# EAGLE design Group 5 (EAGLE 7.1.0)
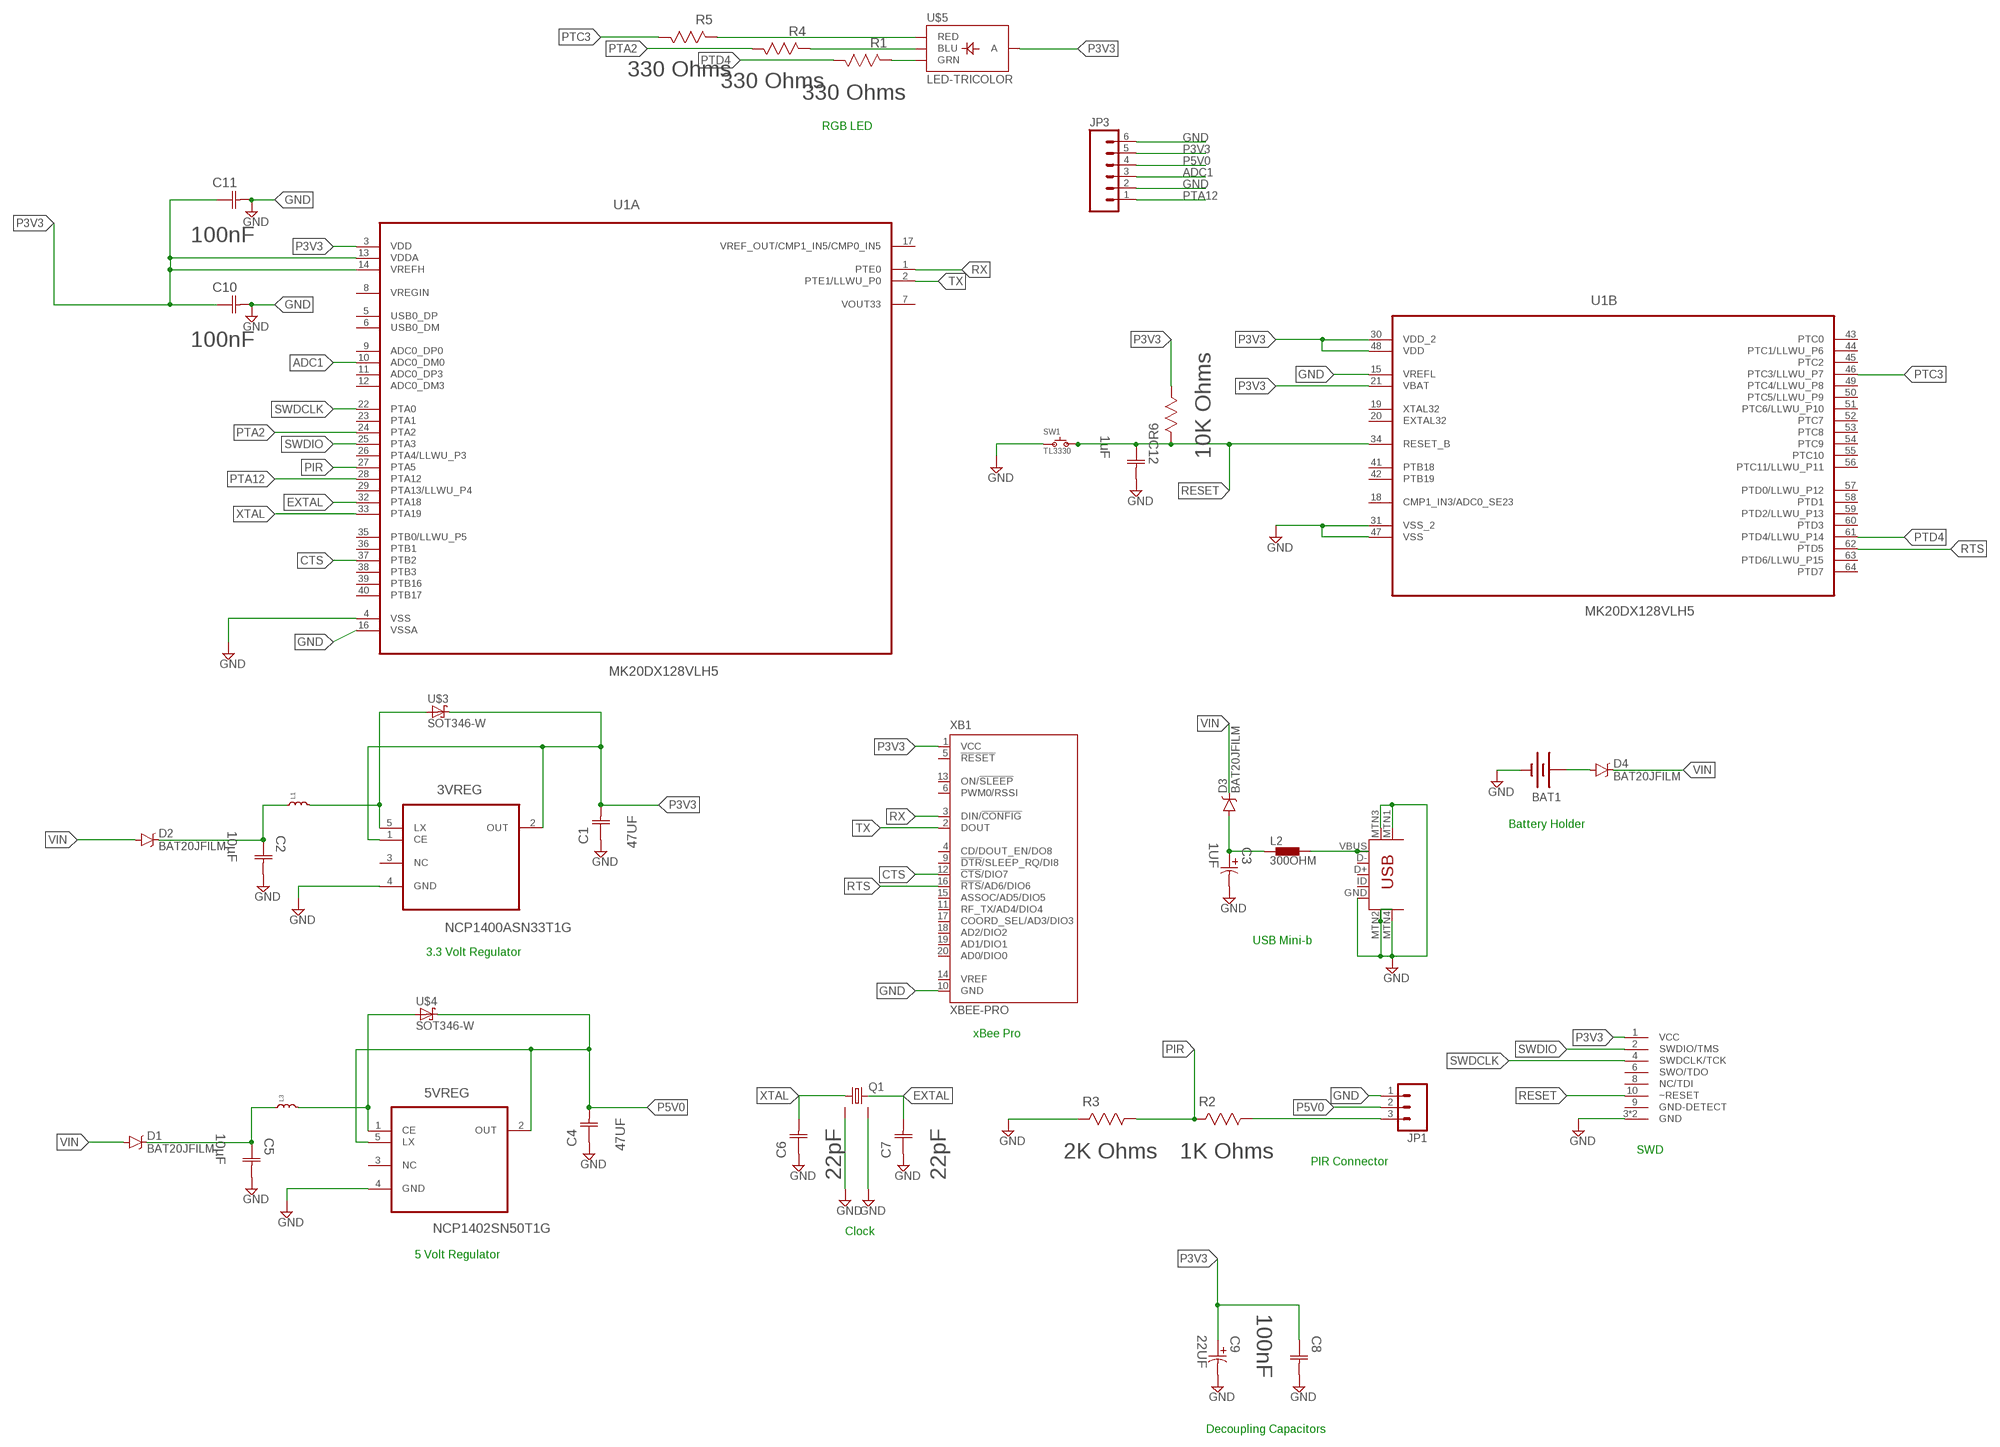
[diagram p0: schematic, sheet 1]

## Parts
3VREG  NCP1400ASN33T1G  [SOT95P275X110-5N]
5VREG  NCP1402SN50T1G  [SOT95P275X110-5N]
BAT1  BATTERY20PTH  [BATTCOM_20MM_PTH]
C1  47UF  TPSC476M010R0350  [CAPCP6032X280N]
C2  10µF  TAJC106M020R  [CAPCP6032X280N]
C3  1UF  EEE-1HA010SR-CASE-B  [CAPAE430X610N]
C4  47UF  TPSC476M010R0350  [CAPCP6032X280N]
C5  10µF  TAJC106M020R  [CAPCP6032X280N]
C6  22pF  C0603C220J5GACTU  [CAPC1608X85N]
C7  22pF  C0603C220J5GACTU  [CAPC1608X85N]
C8  100nF  CC0805KRX7R9BB104  [CAPC2013X95N]
C9  22UF  EEE-FT1V220AR-CASE-B  [CAPAE430X610N]
C10  100nF  CC0805KRX7R9BB104  [CAPC2013X95N]
C11  100nF  CC0805KRX7R9BB104  [CAPC2013X95N]
C12  1uF  0603YC105KAT2A  [CAPC1608X94N]
D1  BAT20JFILM  [SOD-323]
D2  BAT20JFILM  [SOD-323]
D3  BAT20JFILM  [SOD-323]
D4  BAT20JFILM  [SOD-323]
JP1  M03PTH  [1X03]
JP3  M06LONGPADS  [1X06_LONGPADS]
L1  INDUCTOR-SDR0403  [SDR0403]
L2  300OHM  BLM15HB121SN1  [0402]
L3  INDUCTOR-SDR0403  [SDR0403]
Q1  CRYSTALCTS406  [CTS406]
R1  330 Ohms  MC0.1W08051%330R  [RESC2013X65N]
R2  1K Ohms  MC0.125W12061%1K  [RESC3216X71N]
R3  2K Ohms  MC0.125W12061%2K  [RESC3216X71N]
R4  330 Ohms  MC0.1W08051%330R  [RESC2013X65N]
R5  330 Ohms  MC0.1W08051%330R  [RESC2013X65N]
R6  10K Ohms  MC0.063W06035%10K  [RESC1608X60N]
SW1  TL3330  [TL3330]
U1  MK20DX128VLH5  [QFP50P1200X1200X160-64N]
U$1  2X5_0.05"_CORTEX_DEBUGTH_NOKEY_UNSHROUDED  [2X5_0.05"_TH_NS]
U$2  USB-MINIB-5PIN  [USB-MINIB]
U$3  SOT346-W  [SOT346-W]
U$4  SOT346-W  [SOT346-W]
U$5  LED-TRICOLOR  [LED-TRICOLOR-SMD]
XB1  XBEE-PRO  [XBEE-PRO]

## Nets
ADC1: JP3.3 U1.10(A:ADC0_DM0)
CTS: U1.37(A:PTB2) XB1.12(!CTS!/DIO7)
EXTAL: C7.2(C2) Q1.3 U1.32(A:PTA18)
GND: 3VREG.4(GND) 5VREG.4(GND) BAT1.2(-) C1.1(C1) C2.2(C2) C3.2 C4.1(C1) C5.2(C2) C6.1(C1) C7.1(C1) C8.2(C2) C9.2 C10.2(C2) C11.2(C2) C12.2(C2) JP1.1 JP3.2 JP3.6 Q1.2(GND1) Q1.4(GND2) R3.2(R2) SW1.1 U1.4(A:VSS) U1.15(B:VREFL) U1.16(A:VSSA) U1.31(B:VSS_2) U1.47(B:VSS) U$1.3(GND) U$1.5(GND) U$2.GND U$2.MTN1(MTN2) U$2.MTN2(MTN3) U$2.MTN3(MTN1) U$2.MTN4 XB1.10(GND)
N$1: 3VREG.5(LX) L1.2 U$3.1(A)
N$2: L2.2 U$2.VBUS
N$3: 5VREG.1(CE) L3.2 U$4.1(A)
N$5: JP1.3 R2.1(R1)
N$6: R1.2(R2) U$5.G(GRN)
N$7: R4.2(R2) U$5.B(BLU)
N$8: R5.2(R2) U$5.R(RED)
N$10: BAT1.1(+) D4.A
P3V3: 3VREG.1(CE) 3VREG.2(OUT) C1.2(C2) C8.1(C1) C9.1 C10.1(C1) C11.1(C1) JP3.5 R6.1(R1) U1.3(A:VDD) U1.13(A:VDDA) U1.14(A:VREFH) U1.21(B:VBAT) U1.30(B:VDD_2) U1.48(B:VDD) U$1.1(VCC) U$3.3(C) U$5.A XB1.1(VCC)
P5V0: 5VREG.2(OUT) 5VREG.5(LX) C4.2(C2) JP1.2 JP3.4 U$4.3(C)
PIR: R2.2(R2) R3.1(R1) U1.27(A:PTA5)
PTA2: R4.1(R1) U1.24(A:PTA2)
PTA12: JP3.1 U1.28(A:PTA12)
PTC3: R5.1(R1) U1.46(B:PTC3/LLWU_P7)
PTD4: R1.1(R1) U1.61(B:PTD4/LLWU_P14)
RE: C2.1(C1) D2.C L1.1
RE3: C5.1(C1) D1.C L3.1
RESET: C12.1(C1) R6.2(R2) SW1.2 U1.34(B:RESET_B) U$1.10(~RESET)
RTS: U1.62(B:PTD5) XB1.16(!RTS!/AD6/DIO6)
RX: U1.1(A:PTE0) XB1.3(DIN/!CONFIG)
SWDCLK: U1.22(A:PTA0) U$1.4(SWDCLK/TCK)
SWDIO: U1.25(A:PTA3) U$1.2(SWDIO/TMS)
TX: U1.2(A:PTE1/LLWU_P0) XB1.2(DOUT)
VIN: D1.A D2.A D3.C D4.C
VIN3: C3.1 D3.A L2.1
XTAL: C6.2(C2) Q1.1 U1.33(A:PTA19)
Unconnected: 3VREG.3(NC) 5VREG.3(NC) U1.5(A:USB0_DP) U1.6(A:USB0_DM) U1.7(A:VOUT33) U1.8(A:VREGIN) U1.9(A:ADC0_DP0) U1.11(A:ADC0_DP3) U1.12(A:ADC0_DM3) U1.17(A:VREF_OUT/CMP1_IN5/CMP0_IN5) U1.18(B:CMP1_IN3/ADC0_SE23) U1.19(B:XTAL32) U1.20(B:EXTAL32) U1.23(A:PTA1) U1.26(A:PTA4/LLWU_P3) U1.29(A:PTA13/LLWU_P4) U1.35(A:PTB0/LLWU_P5) U1.36(A:PTB1) U1.38(A:PTB3) U1.39(A:PTB16) U1.40(A:PTB17) U1.41(B:PTB18) U1.42(B:PTB19) U1.43(B:PTC0) U1.44(B:PTC1/LLWU_P6) U1.45(B:PTC2) U1.49(B:PTC4/LLWU_P8) U1.50(B:PTC5/LLWU_P9) U1.51(B:PTC6/LLWU_P10) U1.52(B:PTC7) U1.53(B:PTC8) U1.54(B:PTC9) U1.55(B:PTC10) U1.56(B:PTC11/LLWU_P11) U1.57(B:PTD0/LLWU_P12) U1.58(B:PTD1) U1.59(B:PTD2/LLWU_P13) U1.60(B:PTD3) U1.63(B:PTD6/LLWU_P15) U1.64(B:PTD7) U$1.6(SWO/TDO) U$1.8(NC/TDI) U$1.9(GND-DETECT) U$2.D+ U$2.D- U$2.ID XB1.4(CD/DOUT_EN/DO8) XB1.5(!RESET) XB1.6(PWM0/RSSI) XB1.9(!DTR!/SLEEP_RQ/DI8) XB1.11(RF_TX/AD4/DIO4) XB1.13(ON/!SLEEP) XB1.14(VREF) XB1.15(ASSOC/AD5/DIO5) XB1.17(COORD_SEL/AD3/DIO3) XB1.18(AD2/DIO2) XB1.19(AD1/DIO1) XB1.20(AD0/DIO0)

## Notes on the sheet
- RGB LED
- Battery Holder
- USB Mini-b
- 3.3 Volt Regulator
- xBee Pro
- SWD
- PIR Connector
- Clock
- 5 Volt Regulator
- Decoupling Capacitors

## Library data of the parts
3VREG = ON Semiconductor_By_element14_Batch_1:NCP1400ASN33T1G: Switching Regulator; MPN: NCP1400ASN33T1G; OC_FARNELL: 1652392; OC_NEWARK: 42K1839; PACKAGE: SOT-23-5; SUPPLIER: ON SEMICONDUCTOR
5VREG = ON Semiconductor_By_element14_Batch_1:NCP1402SN50T1G: 200 mA, PFM Step-Up Micropower Switching Regulator; MPN: NCP1402SN50T1G; OC_FARNELL: 1652393; OC_NEWARK: 98H0882; PACKAGE: SOT-23-5; SUPPLIER: ON SEMICONDUCTOR
BAT1 = SparkFun-Electromechanical:BATTERY: Battery Holders Various common sizes : AA, AAA, 18650 (PRT-12895), 20mm coin cell and 12mm coin cell. 20MM_4LEGS, BATT-10373
C1 C4 = AVX_By_element14_Batch_1:TPSC476M010R0350: Tantalum Capacitor , 2312; CAPACITANCETOLERANCE: ±20%; MPN: TPSC476M010R0350; OC_FARNELL: -; OC_NEWARK: 75M2932; SUPPLIER: AVX; VOLTAGERATING: 10V
C2 C5 = AVX_By_element14_Batch_1:TAJC106M020R: Tantalum Capacitor , 2312; CAPACITANCETOLERANCE: ±20%; MPN: TAJC106M020R; OC_FARNELL: -; OC_NEWARK: 75M2822; SUPPLIER: AVX; VOLTAGERATING: 20V
C3 = Panasonic-EEE0_EEE1_EEE2_EEEFC:EEE-: Aluminum Electrolytic Capacitors,Surface Mount Type; MPN: EEE-1HA010SR; OC_FARNELL: 9697063; OC_NEWARK: 96K9436; PACKAGE: CASE-B; SUPPLIER: PANASONIC; TOLERANCE: 20%; VOLTAGERATING: 50V
C6 C7 = Kemet_By_element14_Batch_1:C0603C220J5GACTU: CAPACITOR, 0603; MPN: C0603C220J5GACTU; OC_FARNELL: 1414622; OC_NEWARK: 64K2846; SUPPLIER: Kemet; TOLERANCE: ±5%; VOLTAGERATING: 50V
C8 C10 C11 = Yageo_By_element14_Batch_1:CC0805KRX7R9BB104: CAPACITOR, 0805; MPN: CC0805KRX7R9BB104; OC_FARNELL: 3019949; OC_NEWARK: 68R4910; SUPPLIER: Yageo; TOLERANCE: ±10%; VOLTAGERATING: 50V
C9 = Panasonic-EEEFT_EEEH:EEE-: Aluminum Electrolytic Capacitors,Surface Mount Type; MPN: EEE-FT1V220AR; OC_FARNELL: 1868413; OC_NEWARK: 31T8187; PACKAGE: CASE-B; SUPPLIER: PANASONIC; TOLERANCE: ±20 %; VOLTAGERATING: 35V
C12 = AVX_By_element14_Batch_1:0603YC105KAT2A: Capacitor 0603; MPN: 0603YC105KAT2A; OC_FARNELL: 1658870; OC_NEWARK: 96M1178; SUPPLIER: AVX; TOLERANCE: ±10%; VOLTAGERATING: 16V
D1-D4 = SparkFun-DiscreteSemi:BAT20JFILM: 23V, 1A Schottky diode, SOD-323 package; PROD_ID: DIO-11623
JP1 = SparkFun-Connectors:M03: Header 3 Standard 3-pin 0.1" header. Use with straight break away headers (SKU : PRT-00116), right angle break away headers (PRT-00553), swiss pins (PRT-00743), machine pins (PRT-00117), and female headers (PRT-00115). Molex polarized connector foot print use with SKU : PRT-08232 with associated crimp pins and housings.
JP3 = SparkFun-Connectors:M06: Header 6 Standard 6-pin 0.1" header. Use with straight break away headers (SKU : PRT-00116), right angle break away headers (PRT-00553), swiss pins (PRT-00743), machine pins (PRT-00117), and female headers (PRT-00115). Molex polarized connector foot print use with SKU : PRT-08094 with associated crimp pins and housings. NOTES ON THE VARIANTS LOCK and LOCK_LONGPADS... This footprint was designed to help hold the alignment of a through-hole component (i.e. 6-pin header) while soldering it into place. You may notice that each hole has been shifted either up or down by 0.005 of an inch from it's more standard position (which is a perfectly straight line). This slight alteration caused the pins (the squares in the middle) to touch the edges of the holes. Because they are alternating, it causes a "brace" to hold the component in place. 0.005 has proven to be the perfect amount of "off-center" position when using our standard breakaway headers. Although looks a little odd when you look at the bare footprint, once you have a header in there, the alteration is very hard to notice. Also,if you push a header all the way into place, it is covered up entirely on the bottom side. This idea of altering the position of holes to aid alignment will be further integrated into the Sparkfun Library for other footprints. It can help hold any component with 3 or more connection pins.
L1 L3 = bourns:INDUCTOR
L2 = inductors:BLM15H: EMIFIL (R) Chip Ferrite Bead for GHz Noise Source: http://www.murata.com/ Ferrite Bead BLM15H.pdf
Q1 = CTS406 RTC:CRYSTAL: CRYSTAL; OC_FARNELL: unknown; OC_NEWARK: unknown
R1 R4 R5 = Multicomp_By_element14_Batch_1:MC0.1W08051%330R: RESISTOR, 0805; MPN: MC0.1W08051%330R; OC_FARNELL: 9333037; OC_NEWARK: -; SUPPLIER: Multicomp; TOLERANCE: ±1%; WATTAGE: 1/10 W
R2 = Multicomp_By_element14_Batch_1:MC0.125W12061%1K: RESISTOR, 1206; MPN: MC0.125W12061%1K; OC_FARNELL: 9335757; OC_NEWARK: 39K0871; SUPPLIER: Multicomp; TOLERANCE: ±1%; WATTAGE: 1/8 W
R3 = Multicomp_By_element14_Batch_1:MC0.125W12061%2K: RESISTOR, 1206; MPN: MC0.125W12061%2K; OC_FARNELL: 9336117; OC_NEWARK: 39K0906; SUPPLIER: Multicomp; TOLERANCE: ±1%; WATTAGE: 1/8 W
R6 = Multicomp_By_element14_Batch_1:MC0.063W06035%10K: RESISTOR, 0603; MPN: MC0.063W06035%10K; OC_FARNELL: 9331700; OC_NEWARK: 39K0074; SUPPLIER: Multicomp; TOLERANCE: ±1%; WATTAGE: 1/16 W
SW1 = e-switch:TL3330
U1 = MK20DX128VLH5:MK20DX128VLH5: MCU, KINETIS, K20, CORTEX M4, LQFP-64; MPN: MK20DX128VLH5; OC_FARNELL: 2133572; OC_NEWARK: 24W6502; PACKAGE: LQFP-64; SUPPLIER: FREESCALE SEMICONDUCTOR
U$1 = con-cortex:2X5_0.05"_CORTEX_DEBUG
U$2 = SparkFun-Connectors:USB-MINIB: Mini-USB "B" connector with 5th pin broken out. Created new symbol breaking out 5th "ID" pin in mini/micro USB connector spec. See: http://en.wikipedia.org/wiki/Mini_usb#Cables. Uses same footprint as 4-pin symbol. Also added pins to connect to mounting / shield pads if required (probably not generally needed as signals aren't shielded once they leave the connector).; PROD_ID: CONN-08193
U$3 U$4 = SOT346-W:SOT346-W
U$5 = SparkFun-LED:LED-TRICOLOR: Tri-Color LED SMD Proven layout and schematic for triple color LED in SMD package - common anode. Spark Fun Electronics SKU : COM-07844
XB1 = maxstream:XBEE: XBee (TM) /XBee-PRO(TM) OEM RF Modules Source: MaxStream, Inc. xbee_productmanual.pdf; MPN: XBP24-AWI-001; OC_FARNELL: 1337916; OC_NEWARK: 42M2667

## Board
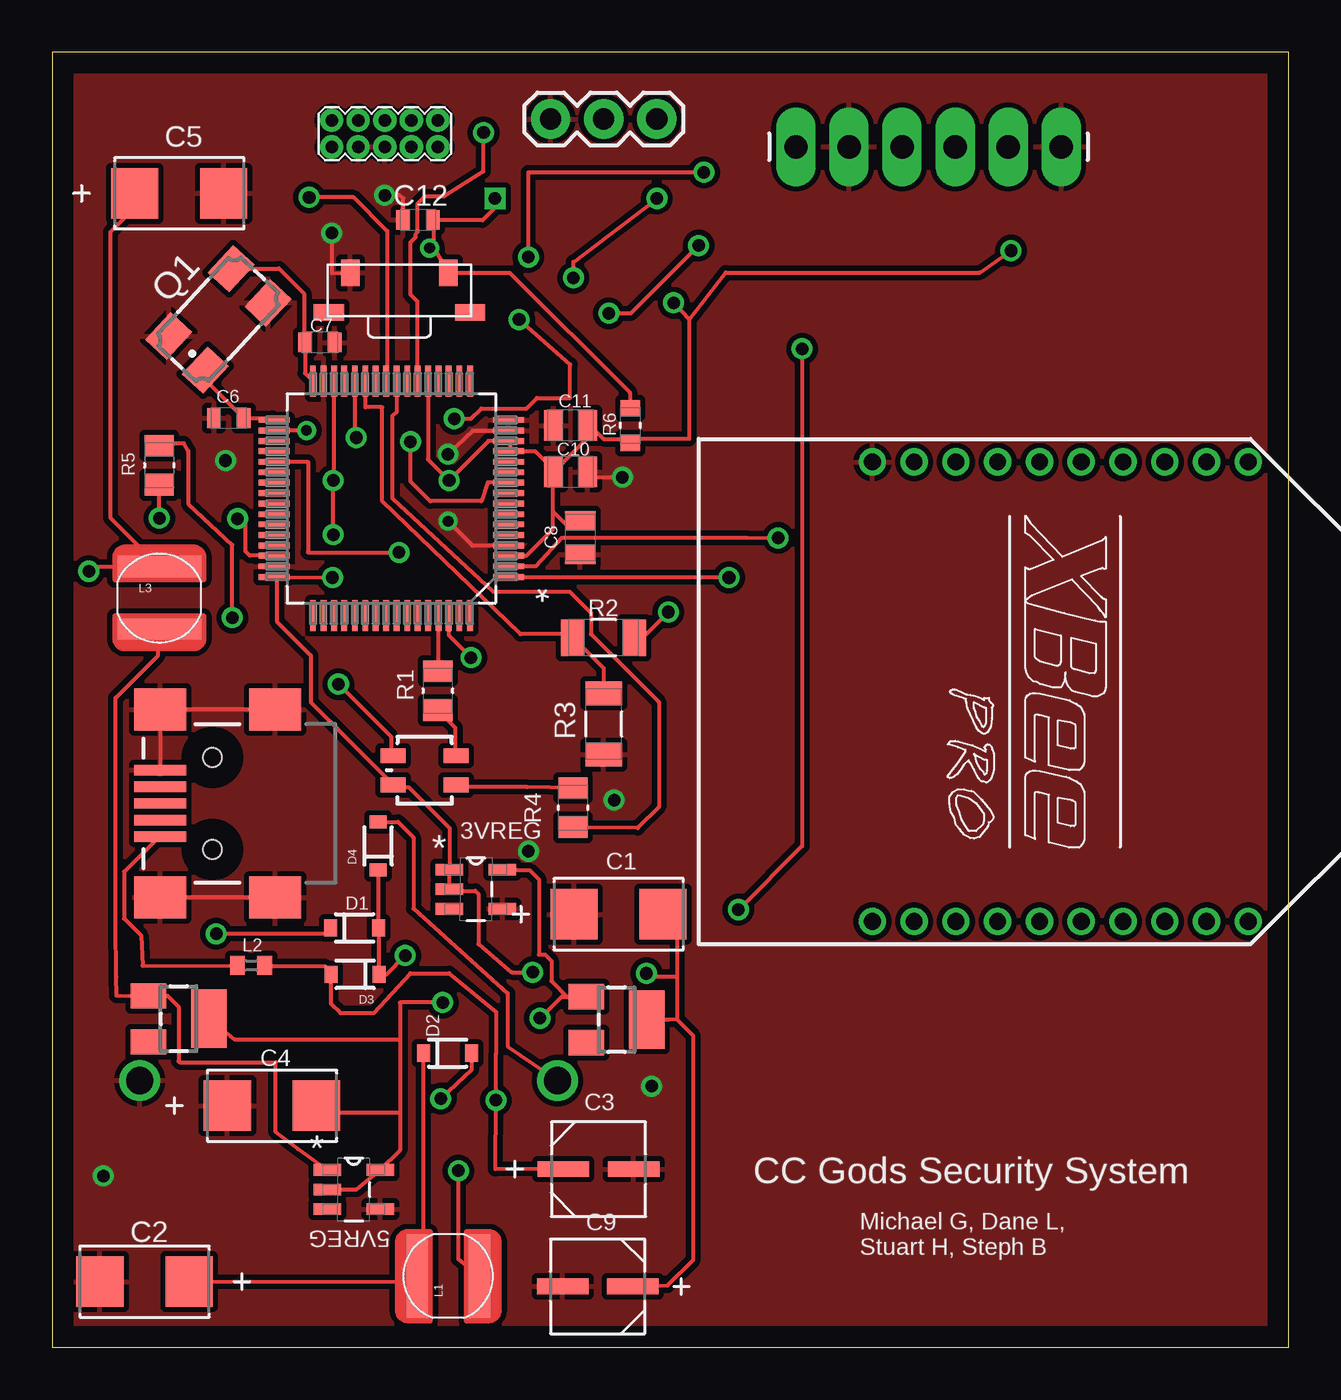
[diagram p1: board, top side]
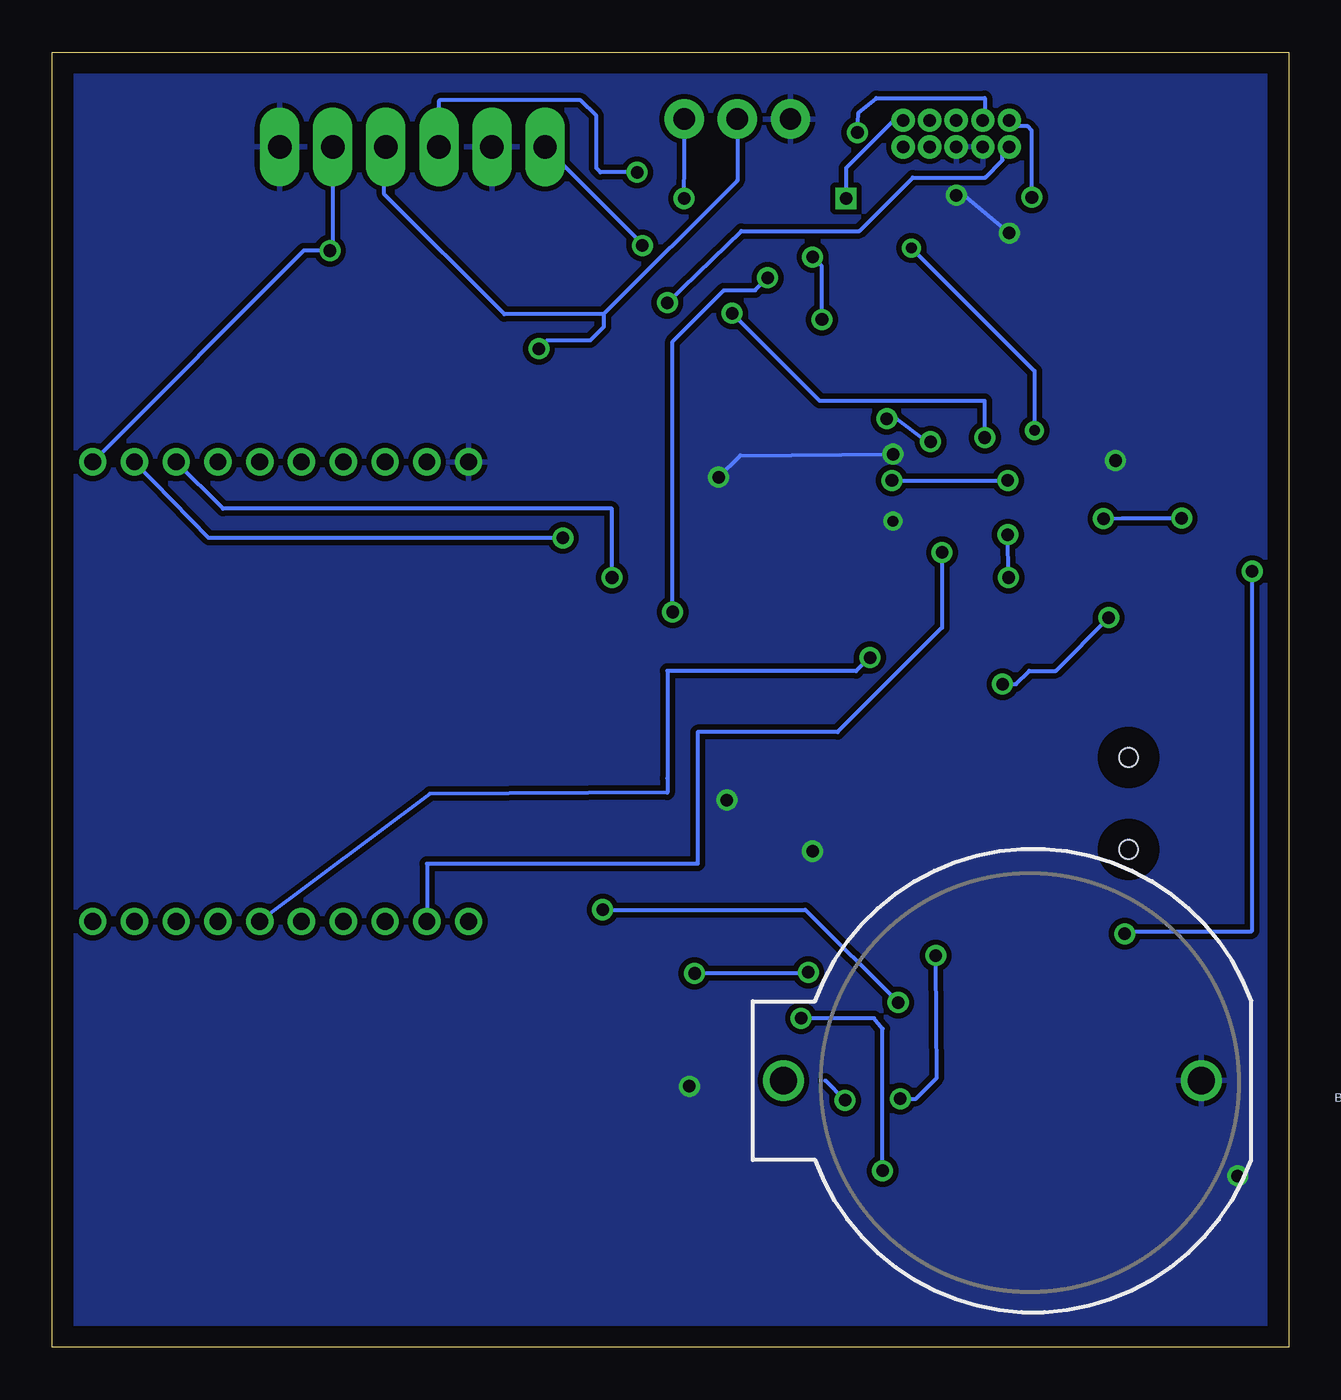
[diagram p2: board, bottom side, seen from below]

Size 59.2 x 62 mm. Coordinates in mm from the lower left corner, seen from the top.
Outline: 0,0 59.2,0 59.2,62 0,62 0,0
Copper layers (1*16): Top 0.035mm / dielectric 1.5mm / Bottom 0.035mm
Design rules "default *": minimum track width 8mil, minimum drill 20mil, track to track 8mil, track to pad 8mil, pad to pad 8mil, via to via 8mil, smd to smd 8mil, copper to edge 40mil, drill to drill 8mil, minimum pad ring 10mil, minimum via ring 8mil, stop-mask expansion 0.00203125mm, vias tented up to drill 0.5mm, thermal gap 10mil

### Footprints (pad centres in the part's own frame; a part is rotated, then mirrored left to right if it is on the bottom)
SOT95P275X110-5N = smd 1.321 x 0.559: 1 -1.27,0.94; 2 -1.27,0; 3 -1.27,-0.94; 4 1.27,-0.94; 5 1.27,0.94
BATTCOM_20MM_PTH = drill 1.3: 1 11.85,0; 2 -8.15,0
CAPCP6032X280N = smd 2.261 x 2.413: 1 -2.134,0; 2 2.134,0
CAPAE430X610N = smd 2.464 x 0.762: 1 -1.676,0; 2 1.676,0
CAPC1608X85N = smd 0.66 x 0.94: 1 -0.711,0; 2 0.711,0
CAPC2013X95N = smd 0.914 x 1.448: 1 -0.813,0; 2 0.813,0
CAPC1608X94N = smd 0.66 x 0.94: 1 -0.711,0; 2 0.711,0
SOD-323 = smd 0.63 x 0.83: A 1.15,0; C -1.15,0
1X03 = drill 1.016 pad 1.88: 1 0,0; 2 2.54,0; 3 5.08,0
1X06_LONGPADS = drill 1.118 pad 1.88 long: 1 0,0; 2 2.54,0; 3 5.08,0; 4 7.62,0; 5 10.16,0; 6 12.7,0
SDR0403 = smd 4 x 1: 1 0,1.5; 2 0,-1.5
0402 = smd 0.7 x 0.9: 1 -0.65,0; 2 0.65,0
CTS406 = smd 1.8 x 1.4: 1 -2.2,-1.2; 2 2.2,-1.2; 3 2.2,1.2; 4 -2.2,1.2
RESC2013X65N = smd 1.016 x 1.397: 1 -0.94,0; 2 0.94,0
RESC3216X71N = smd 1.118 x 1.753: 1 -1.473,0; 2 1.473,0
RESC1608X60N = smd 0.762 x 0.94: 1 -0.838,0; 2 0.838,0
TL3330 = smd 0.889 x 1.27: 1 -2.349,2.032; 2 2.349,2.032 | smd 1.448 x 0.787: NC -3.378,0.14; NC@1 3.378,0.14
QFP50P1200X1200X160-64N = smd 1.473 x 0.279: 1 -5.613,3.759; 2 -5.613,3.251; 3 -5.613,2.743; 4 -5.613,2.261; 5 -5.613,1.753; 6 -5.613,1.245; 7 -5.613,0.762; 8 -5.613,0.254; 9 -5.613,-0.254; 10 -5.613,-0.762; 11 -5.613,-1.245; 12 -5.613,-1.753; 13 -5.613,-2.261; 14 -5.613,-2.743; 15 -5.613,-3.251; 16 -5.613,-3.759; 33 5.613,-3.759; 34 5.613,-3.251; 35 5.613,-2.743; 36 5.613,-2.261; 37 5.613,-1.753; 38 5.613,-1.245; 39 5.613,-0.762; 40 5.613,-0.254; 41 5.613,0.254; 42 5.613,0.762; 43 5.613,1.245; 44 5.613,1.753; 45 5.613,2.261; 46 5.613,2.743; 47 5.613,3.251; 48 5.613,3.759 | smd 0.279 x 1.473: 17 -3.759,-5.613; 18 -3.251,-5.613; 19 -2.743,-5.613; 20 -2.261,-5.613; 21 -1.753,-5.613; 22 -1.245,-5.613; 23 -0.762,-5.613; 24 -0.254,-5.613; 25 0.254,-5.613; 26 0.762,-5.613; 27 1.245,-5.613; 28 1.753,-5.613; 29 2.261,-5.613; 30 2.743,-5.613; 31 3.251,-5.613; 32 3.759,-5.613; 49 3.759,5.613; 50 3.251,5.613; 51 2.743,5.613; 52 2.261,5.613; 53 1.753,5.613; 54 1.245,5.613; 55 0.762,5.613; 56 0.254,5.613; 57 -0.254,5.613; 58 -0.762,5.613; 59 -1.245,5.613; 60 -1.753,5.613; 61 -2.261,5.613; 62 -2.743,5.613; 63 -3.251,5.613; 64 -3.759,5.613
2X5_0.05"_TH_NS = drill 0.6 pad 0.95: 1 -2.54,-0.635; 2 -2.54,0.635; 3 -1.27,-0.635; 4 -1.27,0.635; 5 0,-0.635; 6 0,0.635; 7 1.27,-0.635; 8 1.27,0.635; 9 2.54,-0.635; 10 2.54,0.635
USB-MINIB = smd 2.5 x 0.5: D+ 2.5,0; D- 2.5,0.8; GND 2.5,-1.6; ID 2.5,-0.8; VBUS 2.5,1.6 | smd 2.5 x 2: MTN1 -3,4.5; MTN2 2.5,4.5; MTN3 -3,-4.5; MTN4 2.5,-4.5 | hole 0.9: 0,2.2; 0,-2.2
SOT346-W = smd 1.2 x 1.7: 1 -1.1,-1.45; 2 1.1,-1.45 | smd 2.8 x 1.7: 3 0,1.45
LED-TRICOLOR-SMD = smd 0.7 x 1.2: A 0.7,-1.5; B 0.7,1.5; G -0.7,1.5; R -0.7,-1.5
XBEE-PRO = drill 0.8 pad 1.27: 1 -11,9; 2 -11,7; 3 -11,5; 4 -11,3; 5 -11,1; 6 -11,-1; 7 -11,-3; 8 -11,-5; 9 -11,-7; 10 -11,-9; 11 11,-9; 12 11,-7; 13 11,-5; 14 11,-3; 15 11,-1; 16 11,1; 17 11,3; 18 11,5; 19 11,7; 20 11,9

### Placement (x,y rotation side)
3VREG  20.29,21.93 0 top
5VREG  14.44,7.55 0 top
BAT1  12.34,12.77 180 bottom
C1  27.11,20.73 0 top
C2  4.42,3.14 180 top
C3  26.16,8.53 0 top
C4  10.52,11.56 0 top
C5  6.08,55.24 0 top
C6  8.46,44.48 0 top
C7  12.81,48.1 180 top
C8  25.28,38.77 270 top
C9  26.11,2.92 180 top
C10  24.81,41.91 0 top
C11  24.81,44.13 180 top
C12  17.51,53.98 180 top
D1  14.47,20.08 0 top
D2  18.92,14.09 0 top
D3  14.5,17.85 180 top
D4  15.6,24 90 top
JP1  23.86,58.8 0 top
JP3  35.61,57.47 0 top
L1  18.96,3.4 90 top
L2  9.52,18.29 180 top
L3  5.13,35.88 0 top
Q1  7.95,49.21 47.1 top
R1  18.46,31.43 270 top
R2  26.4,33.97 180 top
R3  26.4,29.84 270 top
R4  24.94,25.84 90 top
R5  5.13,42.23 90 top
R6  27.67,44.13 90 top
SW1  16.62,49.41 0 top
U1  16.24,40.64 180 top
U$1  15.92,58.1 0 top
U$2  7.67,26.04 180 top
U$3  27.02,15.69 270 top
U$4  6.05,15.73 270 top
U$5  17.83,27.62 270 top
XB1  48.27,31.39 270 top

### Tracks (layer width: path | path; a pad name or v marks a point on that pad's centre or on a via)
ADC1  (via drill 0.6)
  Top 0.203: U1.10 20.85,41.4 20.55,40.5 18.1,40.5 17.15,41.45 v17.15,43.35 | v22.35,49.2 24.8,47.05 24.8,45.45 23.2,45.45 22.7,44.95 20.55,44.95 20.05,44.45 v19.25,44.45 | v22.8,52.2 22.8,56.25 v31.2,56.25
  Bottom 0.203: v22.35,49.2 22.35,51.75 v22.8,52.2 | v31.2,56.25 32.95,56.25 33.15,56.45 33.15,58.95 33.9,59.7 40.65,59.7 40.7,59.65 JP3.3 | v17.15,43.35 17.35,43.35 18.8,44.45 v19.25,44.45
CTS  (via drill 0.6)
  Top 0.203: U1.37 12.25,42.39 12.25,38.05 v16.6,38.05
  Bottom 0.203: v16.6,38.05 16.6,34.45 21.6,29.45 28.3,29.45 28.3,23.15 41.27,23.15 XB1.12
EXTAL
  Top 0.203: U1.32 12.1,46.63 C7.2 12.05,48.16 12.05,50.45 10.86,51.64 Q1.3
GND  (via drill 0.51, 0.6)
  Top 0.203: C12.2 16.8,55 16.61,55.15 v15.92,55.15 | v13.38,53.34 13.38,51.44 SW1.1 | U$2.MTN1 U$2.MTN2 | U$2.MTN3 U$2.MTN4 U$2.GND | U1.4 20.12,38.38 v18.95,39.55 | C10.2 25.89,41.65 v27.3,41.65 | v18.95,42.75 20.14,43.89 U1.15
  Bottom 0.203: v15.92,55.15 15.55,55.15 v13.38,53.34 | v27.3,41.65 26.25,42.7 v18.95,42.75
  other vias: 8.3,42.45 28.7,12.5 22.8,23.75 26.9,26.2 2.45,8.2
  pour Bottom (isolate 0.254): -2.35,62.81 61.12,63.46 60.92,-1.17 -1.5,-0.9
  pour Top (isolate 0.254): -4.7,63.31 61.72,63.51 60.7,-1 -2,-2.15
N$1  (via drill 0.6)
  Top 0.203: L1.2 19.45,4.21 v19.45,8.45 | v23.35,15.75 24.39,16.79 24.65,16.79 | 24.65,16.79 U$3.1 | 3VREG.5 21.57,22.85 22.85,22.85 23.3,22.4 23.3,18.8 23.6,18.8 23.9,18.5 23.9,17.54 24.65,16.79
  Bottom 0.203: v19.45,8.45 19.45,15.25 19.85,15.75 v23.35,15.75
N$2
  Top 0.203: L2.2 4.32,18.26 4.25,19.71 3.44,20.52 3.44,22.76 5.06,24.38 U$2.VBUS
N$3
  Top 0.203: L3.2 5.06,34.34 5.06,33.12 3.03,31.09 3.03,20.32 3.07,17.73 3.08,16.84 U$4.1 5.52,16.83 6.05,16.3 6.05,13.7 6.1,13.65 10.7,13.65 10.7,10.3 11.76,9.49 13.06,8.55 5VREG.1
N$5  (via drill 0.6)
  Top 0.203: R2.1 28.27,33.97 v29.5,35.2 | v24.95,51.2 24.95,51.95 v28.95,55
  Bottom 0.203: v29.5,35.2 29.5,48.15 27.05,50.6 25.55,50.6 v24.95,51.2 | v28.95,55 28.94,56.84 JP1.3
N$6
  Top 0.203: R1.2 19.29,29.67 19.29,28.45 U$5.G
N$7
  Top 0.203: R4.2 22.74,26.82 19.49,26.82 U$5.B
N$8  (via drill 0.6)
  Top 0.203: U$5.R 16.24,28.45 16.24,29.21 v13.7,31.75 | R5.2 5.27,43.28 6.3,43.28 6.51,42.91 6.51,40.37 8.62,38.42 v8.62,34.92
  Bottom 0.203: v13.7,31.75 13.06,31.75 12.43,32.38 11.16,32.38 v8.62,34.92
N$10
  Top 0.203: D4.A 16.55,25.15 17.3,24.4 17.3,21 21.8,16.95 21.8,14.41 BAT1.1
P3V3  (via drill 0.6)
  Top 0.203: 21.93,42.88 21.93,43.28 U1.14 20.88,43.38 v19,41.5 17.99,42.51 U1.21 | 25.99,43.89 25.79,44.09 C11.1 25.99,43.89 | 25.99,43.89 26.4,43.48 27.62,43.48 R6.1 27.82,43.48 30.5,43.48 30.5,49.2 | 25.99,43.89 24.16,42.06 C10.1 | 23.96,40.03 24.57,39.42 24.98,39.42 C8.1 | 23.96,40.03 23.96,41.86 C10.1 | 21.93,42.88 23.15,42.88 23.96,42.06 C10.1 | 21.93,42.88 U1.13 | 23.96,40.03 23.96,39.15 22.7,37.9 U1.3 | U1.30 13.5,41.5 v13.45,41.5 v13.45,38.9 | v13.42,36.85 U1.48 10.75,36.78 10.75,34.75 12.38,33.12 12.38,30.89 16.24,27.03 U$5.A 16.44,26.82 17.05,26.82 19.02,24.86 3VREG.1 3VREG.2 | 3VREG.2 19.05,21.89 19.05,21.75 19.02,21.78 3VREG.2 | v23,17.95 22,17.95 20.4,19.3 20.4,21.7 20.25,21.85 19.09,21.85 3VREG.2 | C1.2 29.9,20.08 29.9,17.75 | 29.9,17.75 29.9,15.7 | 29.9,15.7 29.52,15.69 U$3.3 | v28.45,17.9 28.6,17.75 29.9,17.75 | 30.5,49.2 32.25,51.45 44.4,51.45 v45.9,52.5 | v29.75,50 30.5,49.2 | C9.1 29.46,2.96 30.7,4.2 30.7,14.9 29.9,15.7
  Bottom 0.203: 13.39,57.3 U$1.1 13.7,57.15 13.7,56.83 14.53,56 18,56 20.56,53.44 26.21,53.44 v29.75,50 | v19,41.5 v13.45,41.5 | JP3.5 45.77,52.62 45.8,52.55 v45.9,52.5 47.15,52.5 XB1.1 | v13.42,36.85 v13.45,38.9 | v23,17.95 23.05,17.9 v28.45,17.9
P5V0  (via drill 0.6)
  Top 0.203: v35.9,47.8 35.9,24 v32.85,20.95 | v18.7,16.5 16.65,16.5 16.65,14.75 | 16.65,14.75 16.65,11.25 | 16.65,11.25 16.65,9.43 5VREG.5 14.56,7.55 5VREG.2 | U$4.3 8.55,14.88 8.72,14.75 16.65,14.75 | C4.2 12.97,11.25 16.65,11.25
  Bottom 0.203: JP1.2 26.4,55.85 32.8,49.45 | 32.8,49.45 37.55,49.45 43.3,55.2 43.3,57.4 JP3.4 | 32.8,49.45 32.8,48.85 33.45,48.2 35.5,48.2 v35.9,47.8 | v32.85,20.95 23.15,20.95 v18.7,16.5
PIR
  Top 0.203: 15.02,46.13 U1.27 14.99,45 15.8,45 15.8,40.5 22.41,34.14 24.77,34.14 R2.2 24.98,33.93 26.4,32.51 R3.1
PTA2
  Top 0.203: R4.1 28.03,24.86 29.04,25.88 29.04,30.89 25.79,34.14 25.79,35.15 24.77,36.17 21.12,36.17 16.29,40.64 16.29,44.59 16.5,44.8 U1.24 16.49,45.98
PTA12  (via drill 0.6)
  Top 0.203: U1.28 14.49,43.61 v14.55,43.55 | v26.65,49.5 27.7,49.5 v30.95,52.75
  Bottom 0.203: v14.55,43.55 14.55,45.3 22.45,45.3 v26.65,49.5 | v30.95,52.75 30.95,52.81 JP3.1
PTC3  (via drill 0.6)
  Top 0.203: v5.13,39.69 R5.1 | U1.46 9.46,37.9 9.26,38.1 9.26,39.69 v8.87,39.67
  Bottom 0.203: v8.87,39.67 7.99,39.69 v5.13,39.69
PTD4
  Top 0.203: R1.1 18.48,32.51 18.48,34.95 U1.61
RE
  Top 0.203: D2.C 17.77,5.16 17.66,4.9 L1.1 17.51,3.15 C2.1
RE3  (via drill 0.6)
  Top 0.203: D1.C 13.05,19.8 v7.85,19.8 | v1.75,37.15 1.98,37.38 L3.1 2.8,39.7 2.8,53.4 3.95,54.55 C5.1
  Bottom 0.203: v7.85,19.8 7.3,19.9 1.8,19.9 1.75,19.95 v1.75,37.15
RESET  (via drill 0.51, 0.6)
  Top 0.203: 18.27,52.63 SW1.2 21.91,51.44 27.65,45.7 27.65,44.99 R6.2 | 18.27,52.63 18.27,53.85 C12.1 18.25,53.95 20.6,53.95 21.2,54.55 v21.2,55 | v12.18,43.89 U1.34 | 18.27,52.63 v18.07,52.63
  Bottom 0.203: v12.18,43.89 12.18,46.74 v18.07,52.63 | U$1.10 18.91,58.74 21.2,56.45 v21.2,55
RTS  (via drill 0.6)
  Top 0.203: U1.62 18.98,34.09 v20.05,33.02
  Bottom 0.203: v20.05,33.02 20.71,32.37 29.75,32.39 29.75,27.24 29.75,26.55 41.12,26.5 XB1.16
RX  (via drill 0.6)
  Top 0.203: U1.1 32.37,36.88 v32.4,36.85
  Bottom 0.203: v32.4,36.85 32.4,40.15 51.03,40.15 XB1.3
SWDCLK  (via drill 0.6)
  Top 0.203: U1.22 17.48,50.06 17.15,50.4 17.15,52.9 17.4,53.15 17.4,53.3 17.5,53.4 17.5,54.75 17.85,55.1 18.75,55.1 20.65,56.3 v20.65,58.15
  Bottom 0.203: v20.65,58.15 20.6,59.1 19.75,59.8 14.55,59.8 14.55,58.84 U$1.4
SWDIO  (via drill 0.6)
  Top 0.203: U1.25 16.04,46.33 16.04,53.44 14.43,55.05 v12.3,55.05
  Bottom 0.203: v12.3,55.05 12.3,58.25 12.5,58.45 13.1,58.45 U$1.2
TX  (via drill 0.6)
  Top 0.203: U1.2 23.15,37.39 24.41,38.76 33.25,38.76 v34.75,38.75
  Bottom 0.203: XB1.2 55.25,42.39 51.7,38.75 v34.75,38.75
VIN  (via drill 0.6)
  Top 0.203: D4.C 15.62,22.83 D1.A 15.62,17.88 D3.C 16,17.85 v16.9,18.75 | D2.A 20.07,13.27 v18.6,11.9
  Bottom 0.203: v18.6,11.9 17.85,11.9 16.85,12.9 16.9,18.45 v16.9,18.75
VIN3  (via drill 0.6)
  Top 0.203: 10.3,18.26 L2.1 | C3.1 21.22,8.54 v21.25,11.82 21.25,14.09 21.25,16.05 19,17.9 17.15,17.9 15.4,16 13.8,16 13.35,16.45 D3.A 13.05,18.26 10.3,18.26 | 10.3,18.26 10.35,18.2
  Bottom 0.203: v21.25,11.82 22.19,12.77
XTAL
  Top 0.203: Q1.1 7.33,46.32 C6.2 10.54,44.48 U1.33

### Text on the board
tNames: CC Gods Security System | Michael G, Dane L, / Stuart H, Steph B